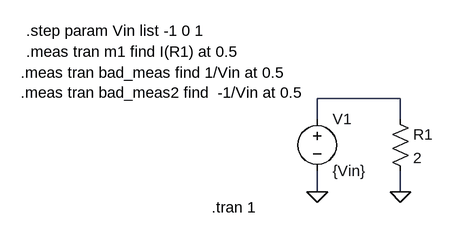
[diagram p0: schematic test9.asc]
test9.asc, the LTspice schematic file:
Version 4
SHEET 1 880 680
WIRE 336 128 208 128
WIRE 208 160 208 128
WIRE 336 160 336 128
WIRE 208 272 208 240
WIRE 336 272 336 240
FLAG 336 272 0
FLAG 208 272 0
SYMBOL voltage 208 144 R0
SYMATTR InstName V1
SYMATTR Value {Vin}
SYMBOL res 320 144 R0
SYMATTR InstName R1
SYMATTR Value 2
TEXT -240 24 Left 2 !.step param Vin list -1 0 1
TEXT 46 296 Left 2 !.tran 1
TEXT -240 56 Left 2 !.meas tran m1 find I(R1) at 0.5
TEXT -248 88 Left 2 !.meas tran bad_meas find 1/Vin at 0.5\n.meas tran bad_meas2 find  -1/Vin at 0.5

The netlist it stands for:
* test9.asc
V1 N001 0 {Vin}
R1 N001 0 2
.step param Vin list -1 0 1
.tran 1
.meas tran m1 find I(R1) at 0.5
.meas tran bad_meas find 1/Vin at 0.5
.meas tran bad_meas2 find  -1/Vin at 0.5
.backanno
.end